# EAGLE design fp_baseline (EAGLE 9.4.2)
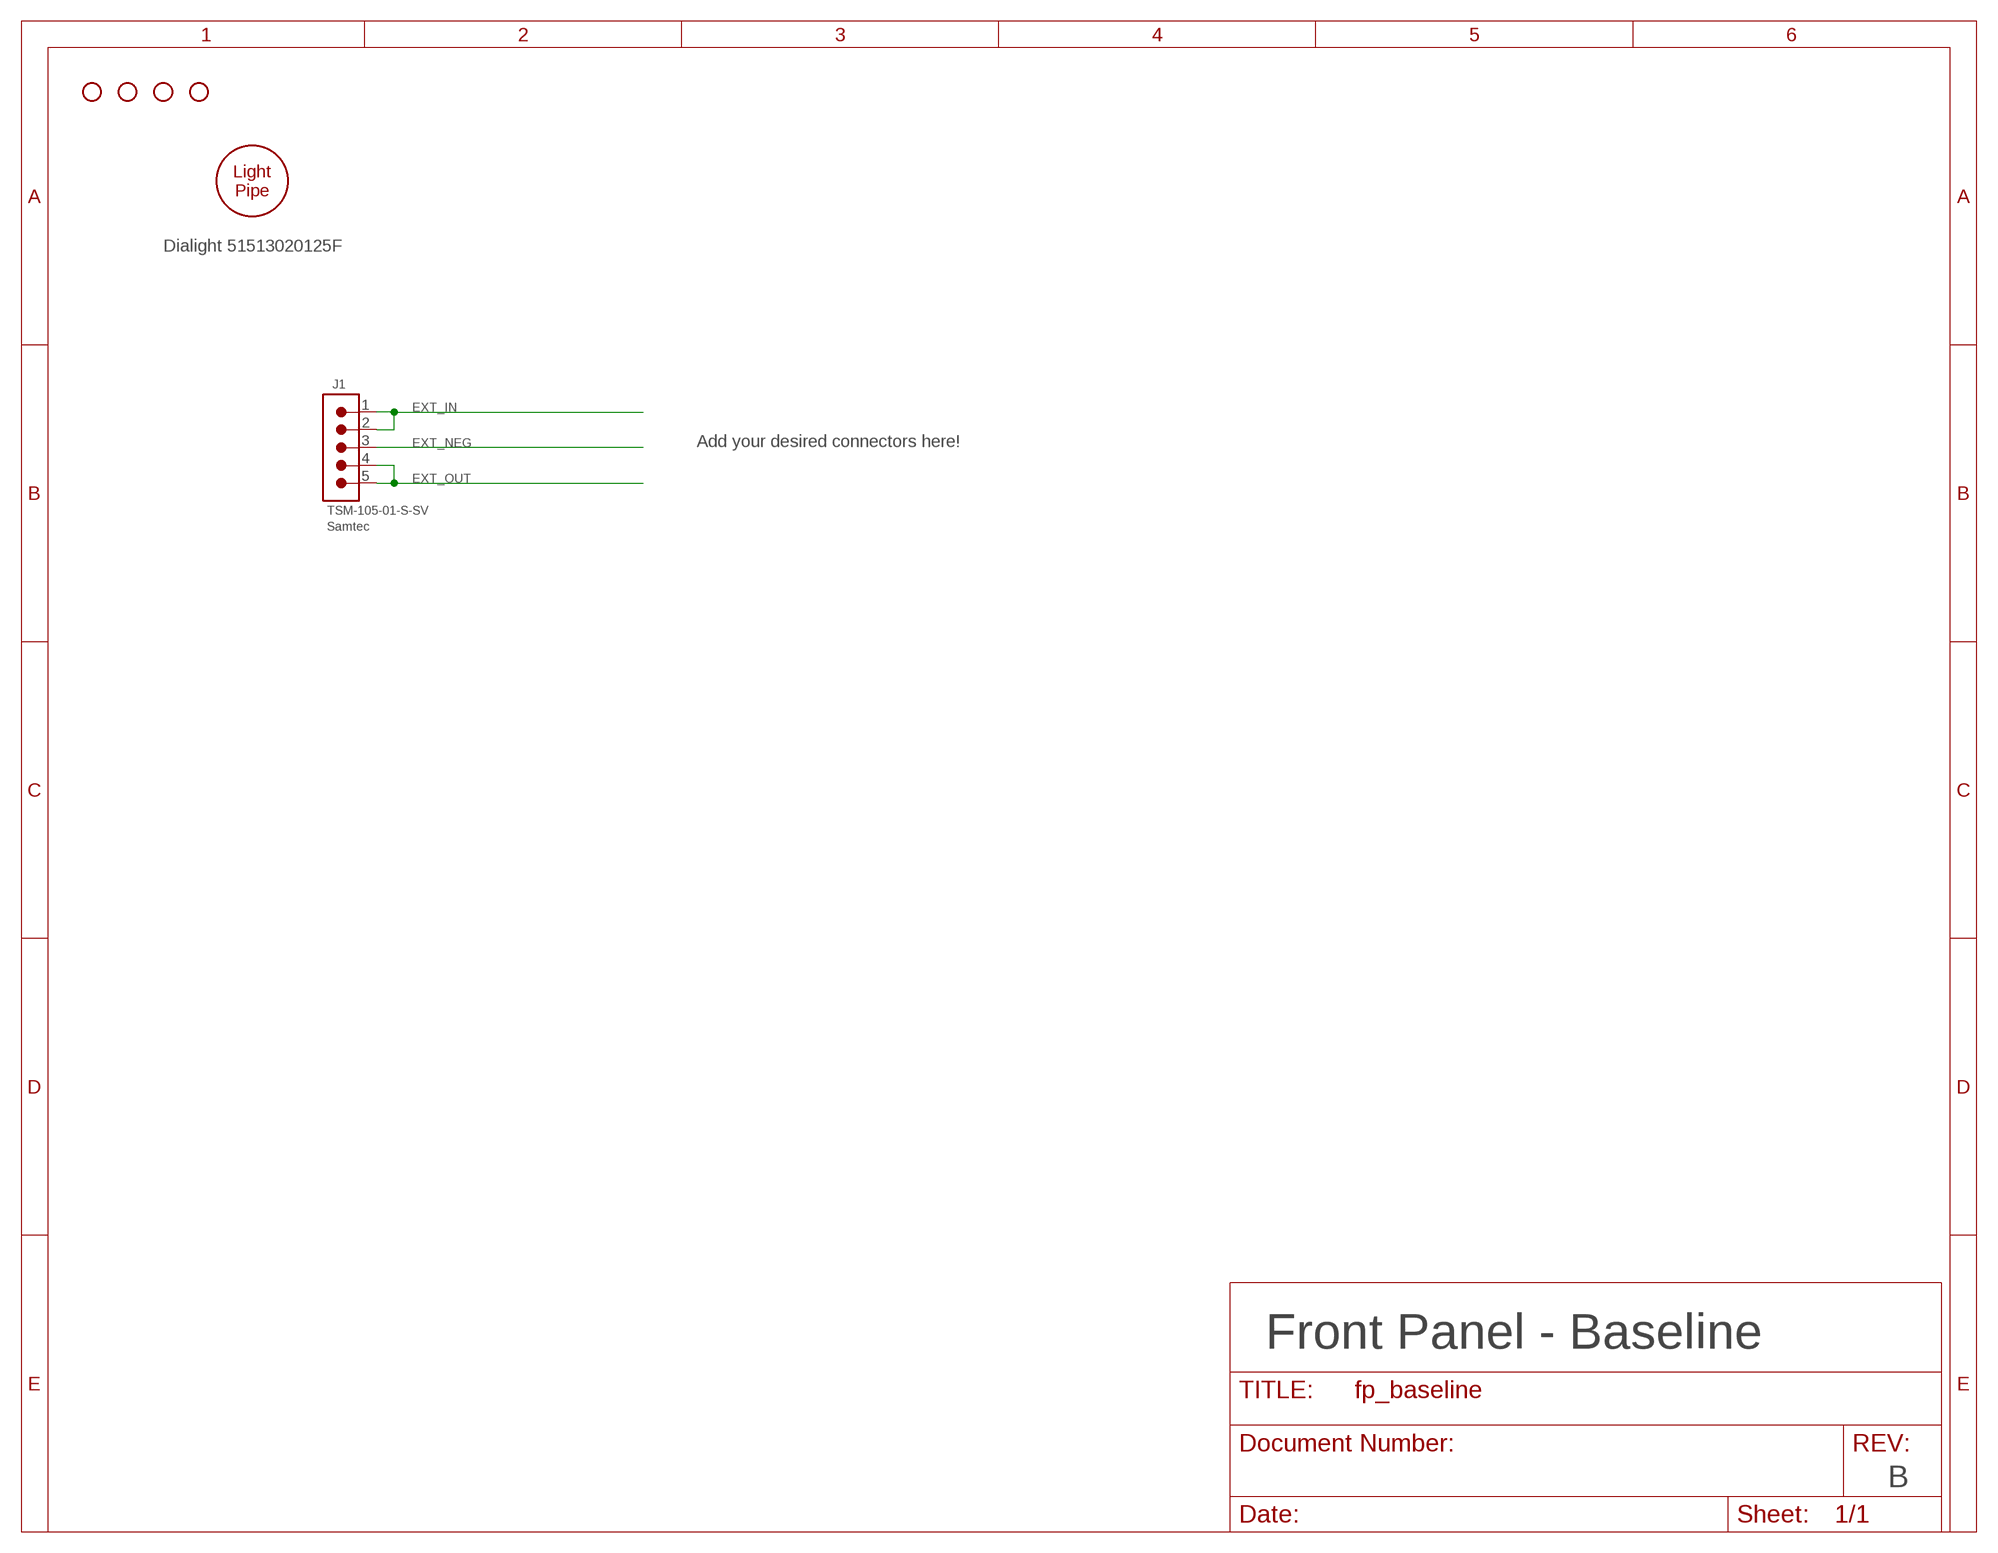
[diagram p0: schematic, sheet 1]

## Parts
H1  51513020125F  LIGHT_PIPE_PANEL_3MM  [LP_3MM]
H2  HOLE_#6  [HOLE_3.5MM]
H3  HOLE_#6  [HOLE_3.5MM]
H4  HOLE_#6  [HOLE_3.5MM]
H5  HOLE_#6  [HOLE_3.5MM]
J1  TSM-105-01-S-SV  CONN_0.1_5X1_MS  [CONN_0.1_5X1_MS]

## Nets
EXT_IN: J1.1 J1.2
EXT_NEG: J1.3
EXT_OUT: J1.4 J1.5

## Notes on the sheet
- Dialight 51513020125F
- Add your desired connectors here!
- Samtec
- Front Panel - Baseline
- B

## Library data of the parts
H1 = jetperch:LIGHT_PIPE; MPN: 51513020125F; POPULATE: 1
H2-H5 = jetperch:HOLE; POPULATE: 0
J1 = jetperch:CONN_0.1_5X1; MPN: TSM-105-01-S-SV; POPULATE: 1

## Board
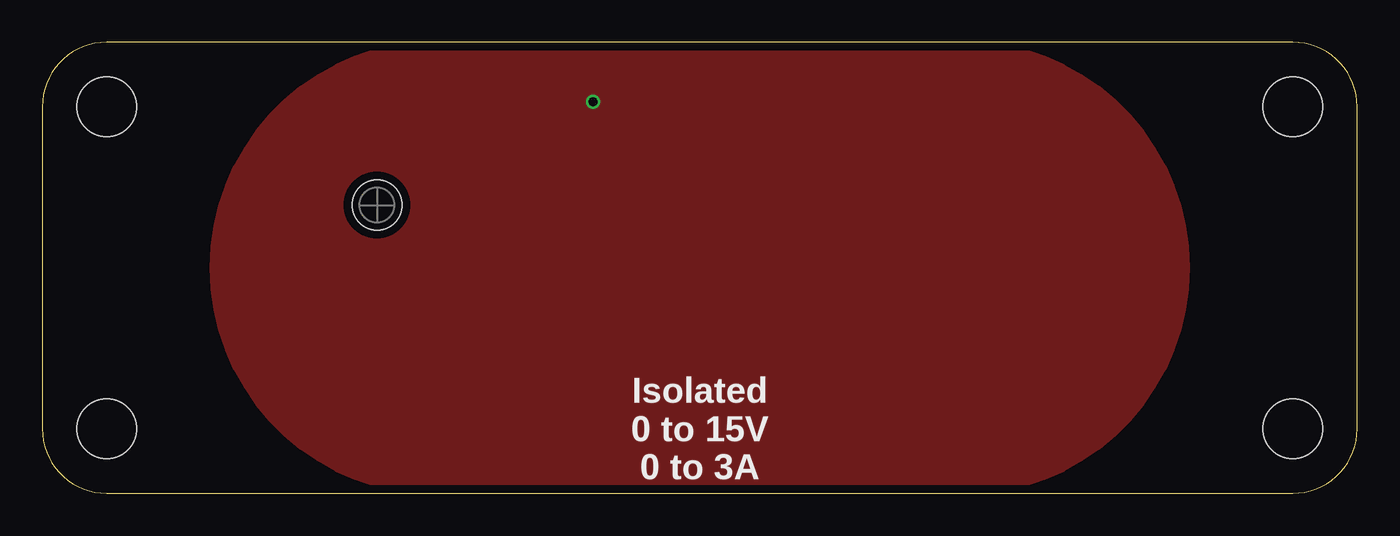
[diagram p1: board, top side]
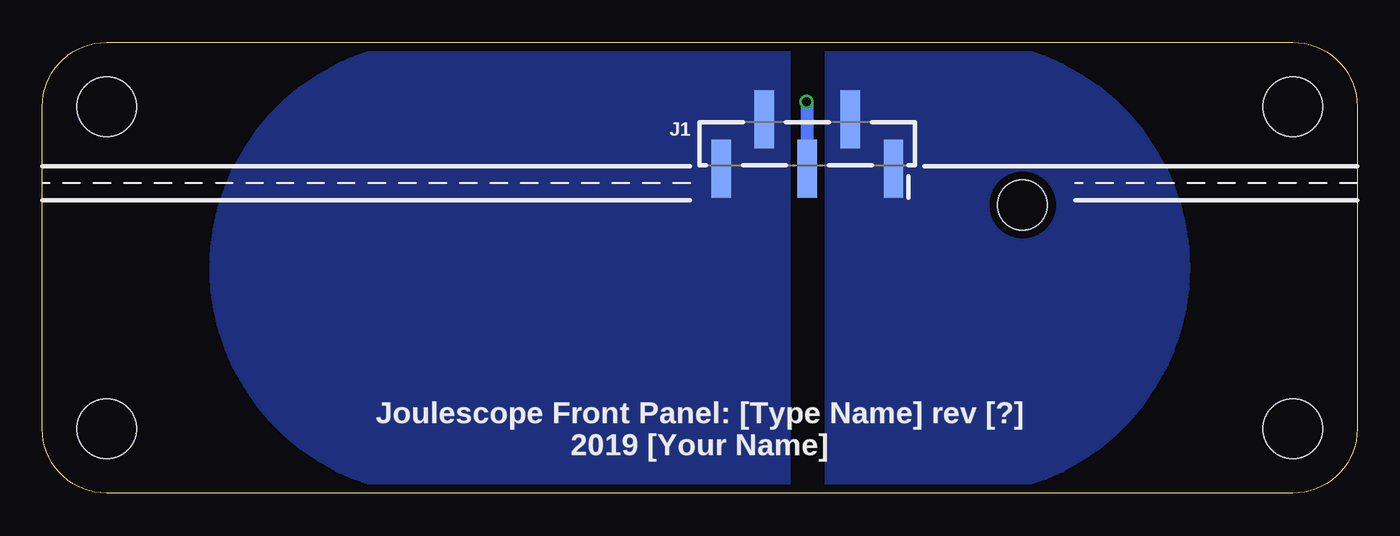
[diagram p2: board, bottom side, seen from below]

Size 77.6 x 26.6 mm. Coordinates in mm from the lower left corner, seen from the top.
Outline: 0,22.81 0,3.79 arc90 3.79,0 73.81,0 arc90 77.6,3.79 77.6,22.81 arc90 73.81,26.6 3.79,26.6 arc90 0,22.81
Copper layers (1*16): Top 0.035mm / dielectric 62mil / Bottom 0.035mm
Design rules "jetperch_2layer *": minimum track width 6mil, minimum drill 15mil, track to track 10mil, track to pad 10mil, pad to pad 10mil, via to via 10mil, smd to smd 0mil, copper to edge 20mil, drill to drill 15mil, minimum pad ring 6mil, minimum via ring 6mil, stop-mask expansion 2mil, vias tented up to drill 22mil, thermal gap 10mil
bKeepout: area 0,17.3 to 25.5,19.3; area 39.5,17.3 to 77.6,19.3; area 3.8,0 to 72.8,1.5; area 3.8,25.1 to 73.8,26.6; area 0,3.8 to 1.5,22.8; area 76.1,3.8 to 77.6,22.8

### Footprints (pad centres in the part's own frame; a part is rotated, then mirrored left to right if it is on the bottom)
LP_3MM = hole 2.921: 0,0
HOLE_3.5MM = hole 3.5: 0,0
CONN_0.1_5X1_MS = smd 1.143 x 3.429: 1 -5.08,1.46; 2 -2.54,-1.46; 3 0,1.46; 4 2.54,-1.46; 5 5.08,1.46

### Placement (x,y rotation side)
H1  19.75,17 0 top
H2  3.79,22.81 0 top
H3  3.79,3.79 0 top
H4  73.81,3.79 0 top
H5  73.81,22.81 0 top
J1  32.45,20.61 180 bottom

### Tracks (layer width: path | path; a pad name or v marks a point on that pad's centre or on a via)
EXT_IN
  pour Bottom (rank 3, no thermals): 31.29,26.6 23.3,26.6 arc90 10,13.3 arc90 23.3,0 31.29,0
EXT_NEG  (via drill 0.51)
  Bottom 0.762: J1.3 32.45,23.05 v32.5,23.1
  pour Top (no thermals): 23.3,26.6 54.3,26.6 arc-90 67.6,13.3 arc-90 54.3,0 23.3,0 arc-90 10,13.3 arc-90
EXT_OUT
  pour Bottom (isolate 0.254, no thermals): 33.56,26.6 54.3,26.6 arc-90 67.6,13.3 arc-90 54.3,0 33.56,0

### Text on the board
tDocu: EXT_NEG | EXT_IN | EXT_OUT
_tsilk: Isolated / 0 to 15V / 0 to 3A
_bsilk: Joulescope Front Panel: [Type Name] rev [?] / 2019 [Your Name]
FabDoc1: Connector: Samtec TSM-105-01-S-SV / ON BACK SIDE / Pinout: / 1,2: EXT_IN / 3: EXT_NEG / 4,5: EXT_OUT | Lightpipe: 0.115" drill / Dialight 51513020125F | All dimensions in millimeters | Backside edge keepout / 1.5 mm wide / (in blue) | Joulescope Front Panel Reference Baseline / Rev B / Last updated: 2019 Aug 12